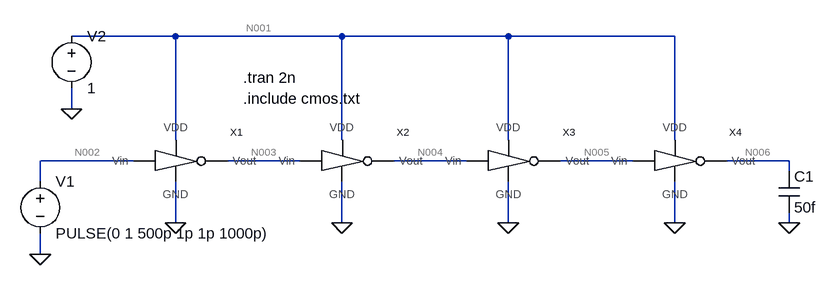
[diagram p0: schematic Draft1.asc]
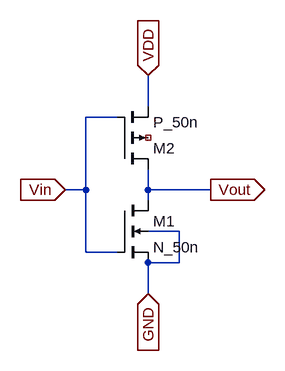
[diagram p1: sub-circuit inverter.asc]
Draft1.asc, the LTspice schematic file:
Version 4
SHEET 1 1216 680
WIRE 224 0 64 0
WIRE 480 0 224 0
WIRE 736 0 480 0
WIRE 992 0 736 0
WIRE 64 112 64 80
WIRE 224 160 224 0
WIRE 480 160 480 0
WIRE 736 160 736 0
WIRE 992 160 992 0
WIRE 160 192 16 192
WIRE 416 192 304 192
WIRE 672 192 560 192
WIRE 928 192 816 192
WIRE 1168 192 1072 192
WIRE 1168 208 1168 192
WIRE 16 224 16 192
WIRE 224 288 224 224
WIRE 480 288 480 224
WIRE 736 288 736 224
WIRE 992 288 992 224
WIRE 1168 288 1168 272
WIRE 16 336 16 304
FLAG 224 288 0
FLAG 16 336 0
FLAG 64 112 0
FLAG 1168 288 0
FLAG 480 288 0
FLAG 736 288 0
FLAG 992 288 0
SYMBOL inverter 224 192 R0
SYMATTR InstName X1
SYMBOL voltage 16 208 R0
WINDOW 123 0 0 Left 0
WINDOW 39 0 0 Left 0
SYMATTR InstName V1
SYMATTR Value PULSE(0 1 500p 1p 1p 1000p)
SYMBOL voltage 64 -16 R0
WINDOW 123 0 0 Left 0
WINDOW 39 0 0 Left 0
SYMATTR InstName V2
SYMATTR Value 1
SYMBOL inverter 480 192 R0
SYMATTR InstName X2
SYMBOL inverter 736 192 R0
SYMATTR InstName X3
SYMBOL inverter 992 192 R0
SYMATTR InstName X4
SYMBOL cap 1152 208 R0
SYMATTR InstName C1
SYMATTR Value 50f
TEXT 328 96 Left 2 !.include cmos.txt
TEXT 328 64 Left 2 !.tran 2n

inverter.asc, the sub-circuit schematic file:
Version 4
SHEET 1 880 680
WIRE 224 64 224 16
WIRE 176 80 128 80
WIRE 128 192 128 80
WIRE 128 192 96 192
WIRE 224 192 224 160
WIRE 320 192 224 192
WIRE 224 208 224 192
WIRE 272 256 224 256
WIRE 128 288 128 192
WIRE 176 288 128 288
WIRE 272 304 272 256
WIRE 272 304 224 304
WIRE 224 352 224 304
FLAG 96 192 Vin
IOPIN 96 192 In
FLAG 224 16 VDD
IOPIN 224 16 In
FLAG 224 352 GND
IOPIN 224 352 In
FLAG 320 192 Vout
IOPIN 320 192 Out
SYMBOL nmos4 176 208 R0
SYMATTR InstName M1
SYMATTR Value N_50n
SYMATTR Value2 l=50n w=500n
SYMBOL pmos4 176 160 M180
SYMATTR InstName M2
SYMATTR Value P_50n
SYMATTR Value2 l=50n w=1u

The netlist it stands for:
* Draft1.asc
XX1 N001 0 N002 N003 inverter
V1 N002 0 PULSE(0 1 500p 1p 1p 1000p)
V2 N001 0 1
XX2 N001 0 N003 N004 inverter
XX3 N001 0 N004 N005 inverter
XX4 N001 0 N005 N006 inverter
C1 N006 0 50f

* block symbol definitions
.subckt inverter VDD GND Vin Vout
M1 Vout Vin GND GND N_50n l=50n w=500n
M2 Vout Vin VDD NC_01 P_50n l=50n w=1u
.ends inverter

.model NMOS NMOS
.model PMOS PMOS
.lib standard.mos
.include cmos.txt
.tran 2n
.backanno
.end

* Results of the author's LTspice run, read from the files saved beside the schematic
* Operating Point, zero values left out:
*   V(n003) = 1 V
*   V(n001) = 1 V
*   V(n004) = 52.47 µV
*   V(n005) = 1 V
*   V(n006) = 33.52 µV
*   I(V1) = 18.11 nA
*   I(V2) = -108.1 nA
*   Ix(x1:VDD) = 34.02 nA
*   Ix(x1:GND) = -3.022 nA
*   Ix(x1:VIN) = -18.11 nA
*   Ix(x1:VOUT) = -12.88 nA
*   Ix(x2:VDD) = 20.03 nA
*   Ix(x2:GND) = -51.02 nA
*   Ix(x2:VIN) = 12.88 nA
*   Ix(x2:VOUT) = 18.11 nA
*   Ix(x3:VDD) = 34.02 nA
*   Ix(x3:GND) = -3.027 nA
*   Ix(x3:VIN) = -18.11 nA
*   Ix(x3:VOUT) = -12.89 nA
*   Ix(x4:VDD) = 20.03 nA
*   Ix(x4:GND) = -32.92 nA
*   Ix(x4:VIN) = 12.89 nA
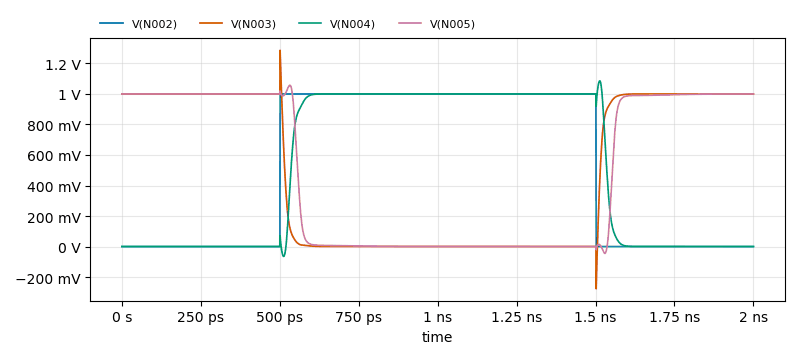
[diagram p2: Transient Analysis of Draft1.asc, plotted from the saved traces]
* Transient Analysis, 1 run:
*   V(N002): min 0 V, max 1 V, average 500.5 mV, rms 707.4 mV, last 0 V
*   V(N003): min -277 mV, max 1.286 V, average 500.2 mV, rms 703.1 mV, last 1 V
*   V(N004): min -64.25 mV, max 1.086 V, average 499.7 mV, rms 701.8 mV, last 55.75 µV
*   V(N005): min -45.34 mV, max 1.057 V, average 501.7 mV, rms 703.1 mV, last 999.9 mV